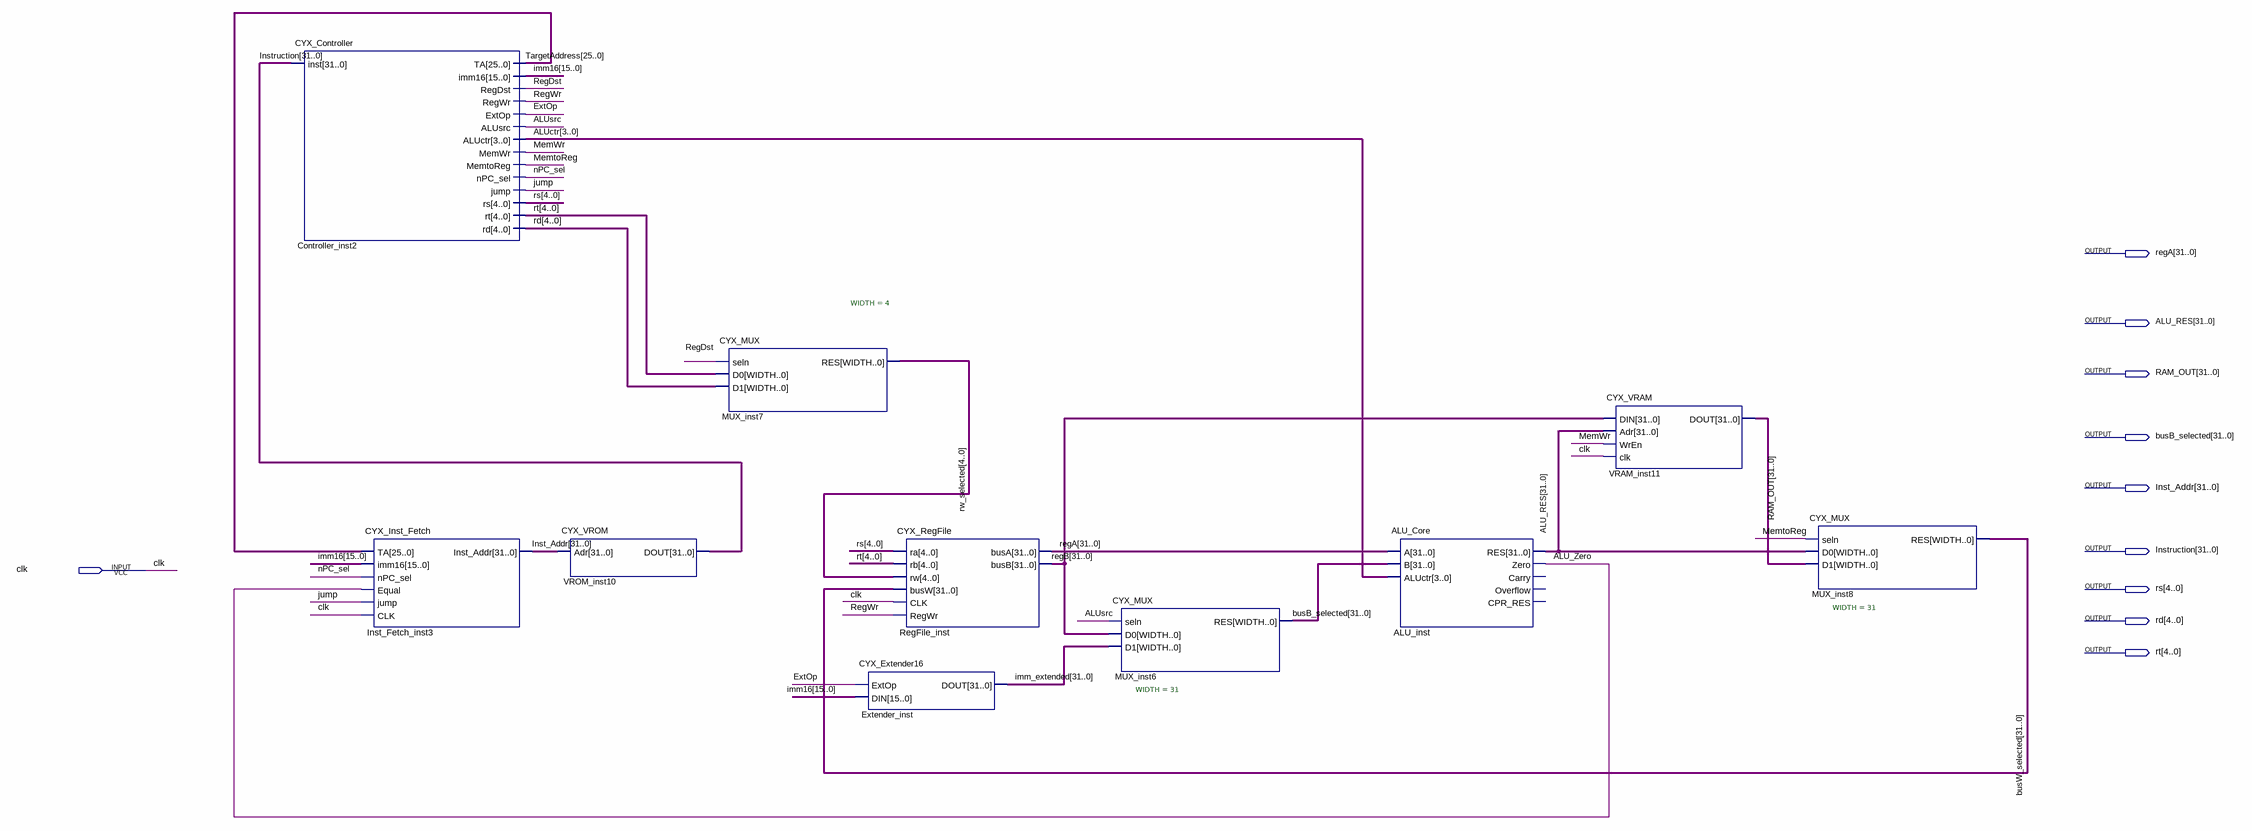
[diagram p0: schematic sheet]
// Quartus schematic CYX_SC_CPU_nanoMIPS.bdf as structural Verilog: 10 symbols, 10 pins
module CYX_SC_CPU_nanoMIPS (
  input  clk,
  output [31:0] regA,
  output [31:0] ALU_RES,
  output [31:0] RAM_OUT,
  output [31:0] busB_selected,
  output [31:0] Inst_Addr,
  output [31:0] Instruction,
  output [4:0] rs,
  output [4:0] rd,
  output [4:0] rt
);

  wire ALU_Zero, ALUsrc, ExtOp, jump, MemtoReg, MemWr, nPC_sel, RegDst, RegWr;
  wire [3:0] ALUctr;
  wire [4:0] rw_selected;
  wire [15:0] imm16;
  wire [25:0] TargetAddress;
  wire [31:0] busW_selected, imm_extended, regB;

  CYX_Controller Controller_inst2 (
    .inst(Instruction), .TA(TargetAddress), .imm16(imm16), .RegDst(RegDst), .RegWr(RegWr), .ExtOp(ExtOp),
    .ALUsrc(ALUsrc), .ALUctr(ALUctr), .MemWr(MemWr), .MemtoReg(MemtoReg), .nPC_sel(nPC_sel), .jump(jump),
    .rs(rs), .rt(rt), .rd(rd));
  CYX_Inst_Fetch Inst_Fetch_inst3 (
    .TA(TargetAddress), .imm16(imm16), .nPC_sel(nPC_sel), .Equal(ALU_Zero), .jump(jump), .CLK(clk),
    .Inst_Addr(Inst_Addr));
  CYX_VROM VROM_inst10 (.Adr(Inst_Addr), .DOUT(Instruction));
  CYX_MUX #(.WIDTH(4)) MUX_inst7 (.seln(RegDst), .D0(rt), .D1(rd), .RES(rw_selected));
  CYX_Extender16 Extender_inst (.ExtOp(ExtOp), .DIN(imm16), .DOUT(imm_extended));
  CYX_RegFile RegFile_inst (
    .ra(rs), .rb(rt), .rw(rw_selected), .busW(busW_selected), .CLK(clk), .RegWr(RegWr), .busA(regA),
    .busB(regB));
  CYX_MUX #(.WIDTH(31)) MUX_inst6 (.seln(ALUsrc), .D0(regB), .D1(imm_extended), .RES(busB_selected));
  ALU_Core ALU_inst (
    .A(regA), .B(busB_selected), .ALUctr(ALUctr), .RES(ALU_RES), .Zero(ALU_Zero));  // open: Carry, Overflow, CPR_RES
  CYX_VRAM VRAM_inst11 (.DIN(regB), .Adr(ALU_RES), .WrEn(MemWr), .clk(clk), .DOUT(RAM_OUT));
  CYX_MUX #(.WIDTH(31)) MUX_inst8 (.seln(MemtoReg), .D0(ALU_RES), .D1(RAM_OUT), .RES(busW_selected));
endmodule
